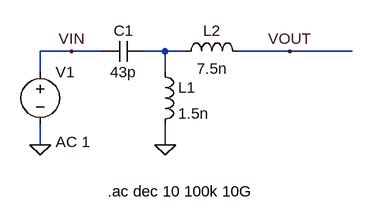
[diagram p0: schematic GNSS_Input.asc]
GNSS_Input.asc, the LTspice schematic file:
Version 4
SHEET 1 880 680
WIRE 64 112 16 112
WIRE 112 112 64 112
WIRE 208 112 176 112
WIRE 240 112 208 112
WIRE 400 112 320 112
WIRE 496 112 400 112
WIRE 16 144 16 112
WIRE 208 144 208 112
WIRE 16 256 16 224
WIRE 208 256 208 224
FLAG 208 256 0
FLAG 16 256 0
FLAG 64 112 VIN
FLAG 400 112 VOUT
SYMBOL cap 176 96 R90
WINDOW 0 0 32 VBottom 2
WINDOW 3 32 32 VTop 2
SYMATTR InstName C1
SYMATTR Value 43p
SYMBOL ind 192 128 R0
SYMATTR InstName L1
SYMATTR Value 1.5n
SYMBOL ind 224 128 R270
WINDOW 0 32 56 VTop 2
WINDOW 3 5 56 VBottom 2
SYMATTR InstName L2
SYMATTR Value 7.5n
SYMBOL voltage 16 128 R0
WINDOW 123 24 124 Left 2
WINDOW 39 0 0 Left 0
SYMATTR Value2 AC 1
SYMATTR InstName V1
SYMATTR Value ""
TEXT 120 328 Left 2 !.ac dec 10 100k 10G

The netlist it stands for:
* GNSS_Input.asc
C1 N001 VIN 43p
L1 N001 0 1.5n
L2 N001 VOUT 7.5n
V1 VIN 0 AC 1
.ac dec 10 100k 10G
.backanno
.end